# Altium schematic sheet SYZYGY_IO_PORTS.SchDoc
size A3; DrawnBy: Orhun Dabak; SheetNumber: 8; SheetTotal: 8
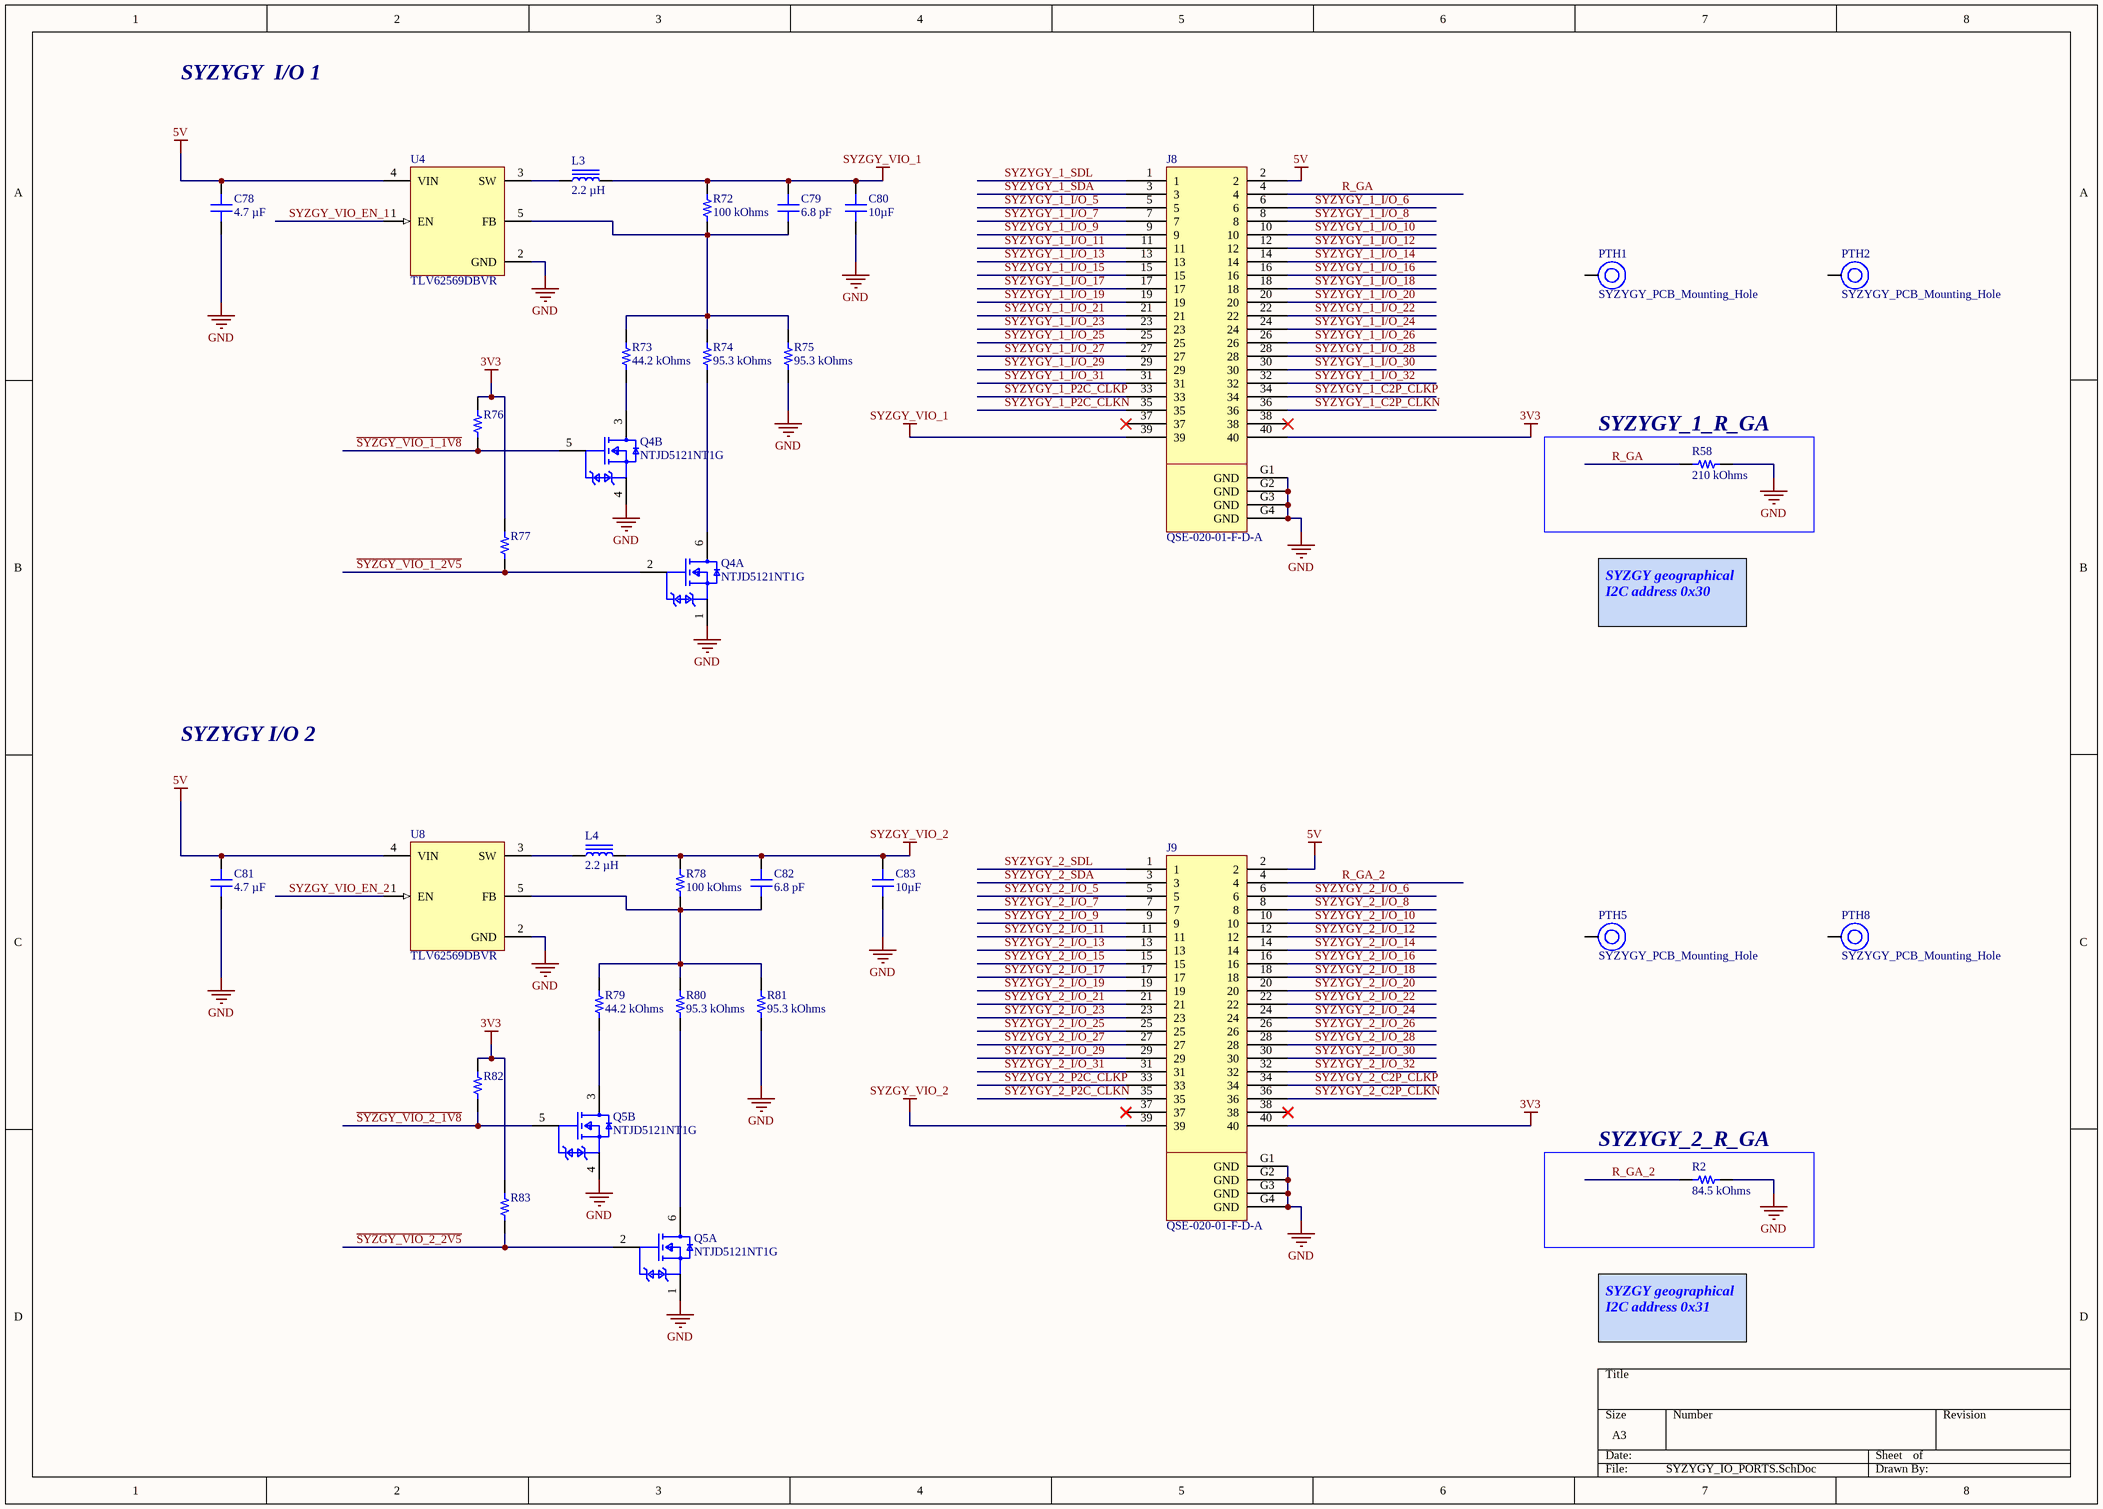
[diagram p0: SYZYGY_IO_PORTS.SchDoc]

## Parts
C78  4.7 µF  [CAP 0805_2012]
C79  6.8 pF  [CAP 0402_1005]
C80  10µF  [CAP 0805_2012]
C81  4.7 µF  [CAP 0805_2012]
C82  6.8 pF  [CAP 0402_1005]
C83  10µF  [CAP 0805_2012]
J8  QSE-020-01-F-D-A  [QSE-020-01-F-D-A-Footprint-1]
J9  QSE-020-01-F-D-A  [QSE-020-01-F-D-A-Footprint-1]
L3  2.2 µH  [TDK VLS252010HBX-1]
L4  2.2 µH  [TDK VLS252010HBX-1]
PTH1  SYZYGY_PCB_Mounting_Hole  [SYZYGY_PCB_Mounting_Hole]  (no BOM)
PTH2  SYZYGY_PCB_Mounting_Hole  [SYZYGY_PCB_Mounting_Hole]  (no BOM)
PTH5  SYZYGY_PCB_Mounting_Hole  [SYZYGY_PCB_Mounting_Hole]  (no BOM)
PTH8  SYZYGY_PCB_Mounting_Hole  [SYZYGY_PCB_Mounting_Hole]  (no BOM)
Q4  NTJD5121NT1G  [FP-419B-02-MFG]  (parts A,B of 2)
Q5  NTJD5121NT1G  [FP-419B-02-MFG]  (parts A,B of 2)
R2  84.5 kOhms  [RES 0402_1005]
R58  210 kOhms  [RES 0402_1005]
R72  100 kOhms  [RES 0402_1005]
R73  44.2 kOhms  [RES 0402_1005]
R74  95.3 kOhms  [RES 0402_1005]
R75  95.3 kOhms  [RES 0402_1005]
R76  10 kOhms  [RES 0201_0603]  (value not drawn)
R77  10 kOhms  [RES 0201_0603]  (value not drawn)
R78  100 kOhms  [RES 0402_1005]
R79  44.2 kOhms  [RES 0402_1005]
R80  95.3 kOhms  [RES 0402_1005]
R81  95.3 kOhms  [RES 0402_1005]
R82  10 kOhms  [RES 0201_0603]  (value not drawn)
R83  10 kOhms  [RES 0201_0603]  (value not drawn)
U4  TLV62569DBVR  [FP-DBV0005A-IPC_C]
U8  TLV62569DBVR  [FP-DBV0005A-IPC_C]

## Blocks framed on the sheet
SYZYGY_1_R_GA: R58
SYZYGY_2_R_GA: R2

## Nets
3V3: J8.40 J9.40 R76.2 R77.2 R82.2 R83.2
5V: C78.2 C81.2 J8.2 J9.2 U4.4(VIN) U8.4(VIN)
GND: C78.1 C80.1 C81.1 C83.1 J8.G1(GND) J8.G2(GND) J8.G3(GND) J8.G4(GND) J9.G1(GND) J9.G2(GND) J9.G3(GND) J9.G4(GND) Q4.1(S1) Q4.4(S2) Q5.1(S1) Q5.4(S2) R2.2 R58.2 R75.1 R81.1 U4.2(GND) U8.2(GND)
SYZGY_VIO_1: C79.2 C80.2 J8.39 L3.2 R72.2
SYZGY_VIO_2: C82.2 C83.2 J9.39 L4.2 R78.2
R_GA: J8.4 R58.1
R_GA_2: J9.4 R2.1
~{SYZGY_VIO_1_1V8}: Q4.5(G2) R76.1
~{SYZGY_VIO_1_2V5}: Q4.2(G1) R77.1
~{SYZGY_VIO_2_1V8}: Q5.5(G2) R82.1
~{SYZGY_VIO_2_2V5}: Q5.2(G1) R83.1
SYZGY_VIO_EN_1: U4.1(EN)
SYZGY_VIO_EN_2: U8.1(EN)
SYZYGY_1_C2P_CLKN: J8.36
SYZYGY_1_C2P_CLKP: J8.34
SYZYGY_1_I/O_5: J8.5
SYZYGY_1_I/O_6: J8.6
SYZYGY_1_I/O_7: J8.7
SYZYGY_1_I/O_8: J8.8
SYZYGY_1_I/O_9: J8.9
SYZYGY_1_I/O_10: J8.10
SYZYGY_1_I/O_11: J8.11
SYZYGY_1_I/O_12: J8.12
SYZYGY_1_I/O_13: J8.13
SYZYGY_1_I/O_14: J8.14
SYZYGY_1_I/O_15: J8.15
SYZYGY_1_I/O_16: J8.16
SYZYGY_1_I/O_17: J8.17
SYZYGY_1_I/O_18: J8.18
SYZYGY_1_I/O_19: J8.19
SYZYGY_1_I/O_20: J8.20
SYZYGY_1_I/O_21: J8.21
SYZYGY_1_I/O_22: J8.22
SYZYGY_1_I/O_23: J8.23
SYZYGY_1_I/O_24: J8.24
SYZYGY_1_I/O_25: J8.25
SYZYGY_1_I/O_26: J8.26
SYZYGY_1_I/O_27: J8.27
SYZYGY_1_I/O_28: J8.28
SYZYGY_1_I/O_29: J8.29
SYZYGY_1_I/O_30: J8.30
SYZYGY_1_I/O_31: J8.31
SYZYGY_1_I/O_32: J8.32
SYZYGY_1_P2C_CLKN: J8.35
SYZYGY_1_P2C_CLKP: J8.33
SYZYGY_1_SDA: J8.3
SYZYGY_1_SDL: J8.1
SYZYGY_2_C2P_CLKN: J9.36
SYZYGY_2_C2P_CLKP: J9.34
SYZYGY_2_I/O_5: J9.5
SYZYGY_2_I/O_6: J9.6
SYZYGY_2_I/O_7: J9.7
SYZYGY_2_I/O_8: J9.8
SYZYGY_2_I/O_9: J9.9
SYZYGY_2_I/O_10: J9.10
SYZYGY_2_I/O_11: J9.11
SYZYGY_2_I/O_12: J9.12
SYZYGY_2_I/O_13: J9.13
SYZYGY_2_I/O_14: J9.14
SYZYGY_2_I/O_15: J9.15
SYZYGY_2_I/O_16: J9.16
SYZYGY_2_I/O_17: J9.17
SYZYGY_2_I/O_18: J9.18
SYZYGY_2_I/O_19: J9.19
SYZYGY_2_I/O_20: J9.20
SYZYGY_2_I/O_21: J9.21
SYZYGY_2_I/O_22: J9.22
SYZYGY_2_I/O_23: J9.23
SYZYGY_2_I/O_24: J9.24
SYZYGY_2_I/O_25: J9.25
SYZYGY_2_I/O_26: J9.26
SYZYGY_2_I/O_27: J9.27
SYZYGY_2_I/O_28: J9.28
SYZYGY_2_I/O_29: J9.29
SYZYGY_2_I/O_30: J9.30
SYZYGY_2_I/O_31: J9.31
SYZYGY_2_I/O_32: J9.32
SYZYGY_2_P2C_CLKN: J9.35
SYZYGY_2_P2C_CLKP: J9.33
SYZYGY_2_SDA: J9.3
SYZYGY_2_SDL: J9.1
NetC79_1: C79.1 R72.1 R73.2 R74.2 R75.2 U4.5(FB)
NetC82_1: C82.1 R78.1 R79.2 R80.2 R81.2 U8.5(FB)
NetL3_1: L3.1 U4.3(SW)
NetL4_1: L4.1 U8.3(SW)
NetQ4_3: Q4.3(D2) R73.1
NetQ4_6: Q4.6(D1) R74.1
NetQ5_3: Q5.3(D2) R79.1
NetQ5_6: Q5.6(D1) R80.1

Not connected (* = marked no-connect by the designer): J8 37* 38*; J9 37* 38*; PTH1 1; PTH2 1; PTH5 1; PTH8 1

## Notes on the sheet
- SYZYGY  I/O 1
- SYZGY geographical I2C address 0x30
- SYZYGY I/O 2
- SYZGY geographical I2C address 0x31

## Library data of the parts
C78 C81 = CL21B475KAFNNNE: CAP CER 4.7UF 25V X7R 0805; manufacturer: Samsung Electro-Mechanics; Tolerance: ±10%; Part Number: CL21B475KAFNNNE; Value: 4.7 µF; Applications: General Purpose; Capacitance: 4.7 µF; componentlink1description: Datasheet; componentlink1url: http://www.samsungsem.com/kr/support/product-search/mlcc/CL21B475KAFNNNE.jsp; componentlink2description: DigiKey Link; componentlink2url: https://www.digikey.com/en/products/detail/samsung-electro-mechanics/CL21B475KAFNNNE/3888627; Device Package: 0805 (2012 Metric); lastupdated: 19/09/2022 13:04:25; Lifecycle Status: Active; Minimum Order: 1; Mounting Type: Surface Mount, MLCC; Operating Temperature: -55°C ~ 125°C; Package / Case: 0805 (2012 Metric); packaging: TapeAndReel; partid: 3072; Part Status: Active; price: 0.09; series: CL; Size / Dimension: 0.079" L x 0.049" W (2.00mm x 1.25mm); Supplier 1: DigiKey; Supplier Part Number 1: 1276-2969-1-ND; Temperature Coefficient: X7R; Thickness (Max): 0.053" (1.35mm); Voltage - Rated: 25V
C79 C82 = 885012005024: CAP CER 6.8PF 16V C0G/NP0 0402; manufacturer: Würth Elektronik; Temperature Coefficient: C0G, NP0; Tolerance: ±0.5pF; Part Number: 885012005024; Value: 6.8 pF; Applications: General Purpose; Capacitance: 6.8 pF; componentlink1description: Datasheet; componentlink1url: https://katalog.we-online.de/pbs/datasheet/885012005024.pdf; componentlink2description: DigiKey Link; componentlink2url: https://www.digikey.com/en/products/detail/würth-elektronik/885012005024/5453295; Device Package: 0402 (1005 Metric); lastupdated: 19/09/2022 12:57:16; Lifecycle Status: Active; Minimum Order: 1; Mounting Type: Surface Mount, MLCC; Operating Temperature: -55°C ~ 125°C; Package / Case: 0402 (1005 Metric); packaging: TapeAndReel; partid: 8046; Part Status: Active; price: 0.01; series: WCAP-CSGP; Size / Dimension: 0.039" L x 0.020" W (1.00mm x 0.50mm); Supplier 1: DigiKey; Supplier Part Number 1: 732-7440-1-ND; Thickness (Max): 0.022" (0.55mm); Voltage - Rated: 16V
C80 C83 = 0805ZC106MAT2A: CAP CER 10UF 10V X7R 0805; manufacturer: AVX Corporation; Tolerance: ±20%; Part Number: 0805ZC106MAT2A; Value: 10µF; Applications: General Purpose; Capacitance: 10µF; componentlink1description: Datasheet; componentlink1url: http://datasheets.avx.com/X7RDielectric.pdf; componentlink2description: DigiKey Link; componentlink2url: http://digikey.com/product-detail/en/avx-corporation/0805ZC106MAT2A/478-11397-1-ND/8019148; Device Package: 0805 (2012 Metric); lastupdated: 02/09/2020 01:04:12; Lifecycle Status: Active; Minimum Order: 1; Mounting Type: Surface Mount, MLCC; Operating Temperature: -55°C ~ 125°C; Package / Case: 0805 (2012 Metric); packaging: CutTape; partid: 16649; Part Status: Active; price: 0.85; series: -; Size / Dimension: 0.079" L x 0.049" W (2.00mm x 1.25mm); Supplier 1: DigiKey; Supplier Part Number 1: 478-11397-1-ND; Temperature Coefficient: X7R; Thickness (Max): 0.060" (1.52mm); Voltage - Rated: 10V
J8 J9 = CMP-002-00073-2: Conn High Speed Socket Strip SKT 40 POS 0.8mm Solder ST SMD Tray
L3 L4 = VLS252010HBX-2R2M-1: FIXED IND 2.2UH 1.76A 120MOHM SM; Manufacturer: TDK Corporation; Current - Saturation: 2.3A; DC Resistance (DCR): 120mOhm Max; Inductance Frequency - Test: 1 MHz; Material - Core: Metal; Shielding: Shielded; Tolerance: ±20%; Type: Drum Core, Wirewound; Part Number: VLS252010HBX-2R2M-1; ComponentLink1Description: Datasheet; ComponentLink1URL: https://product.tdk.com/info/en/catalog/datasheets/inductor_commercial_power_vls252010hbx-1_en.pdf?ref_disty=digikey; ComponentLink2Description: DigiKey Link; ComponentLink2URL: https://www.digikey.com/en/products/detail/tdk-corporation/VLS252010HBX-2R2M-1/4918066; Current Rating (Amps): 1.76 A; Device Package: 1008 (2520 Metric); Height - Seated (Max): 0.039" (1.00mm); Inductance: 2.2 µH; LastUpdated: 9/19/2022 02:01:21 PM; Lifecycle Status: Active; Minimum Order: 1; Mounting Type: Surface Mount; Operating Temperature: -40°C ~ 105°C; Package / Case: 1008 (2520 Metric); Packaging: TapeAndReel; PartId: 3369; Part Status: Active; Price: 0.12; Series: VLS-HBX-1; Size / Dimension: 0.098" L x 0.079" W (2.50mm x 2.00mm); Supplier 1: DigiKey; Supplier Part Number 1: 445-172399-1-ND; Supplier Device Package: 1008 (2520 Metric); Value: 2.2 µH
Q4 Q5 = CMP-013-00036-1: MOSFET 2N-CH 60V 0.295A SOT363
R2 = RC0402FR-0784K5L: RES 84.5K OHM 1% 1/16W 0402; Manufacturer: Yageo; Power (Watts): 0.063W, 1/16W; Temperature Coefficient: ±100ppm/°C; Part Number: RC0402FR-0784K5L; Value: 84.5 kOhms; ComponentLink1Description: Datasheet; ComponentLink1URL: https://www.yageo.com/upload/media/product/productsearch/datasheet/rchip/PYu-RC_Group_51_RoHS_L_10.pdf; ComponentLink2Description: DigiKey Link; ComponentLink2URL: https://www.digikey.com/en/products/detail/yageo/RC0402FR-0784K5L/5281105; Composition: Thick Film; Device Package: 0402 (1005 Metric); Features: Moisture Resistant; Height - Seated (Max): 0.016" (0.40mm); LastUpdated: 9/19/2022 01:15:04 PM; Lifecycle Status: Active; Minimum Order: 1; Number of Terminations: 2; Operating Temperature: -55°C ~ 155°C; Package / Case: 0402 (1005 Metric); Packaging: CutTape; PartId: 2563; Part Status: Active; Price: 0.01; Resistance: 84.5 kOhms; Series: RC_L; Size / Dimension: 0.039" L x 0.020" W (1.00mm x 0.50mm); Supplier 1: DigiKey; Supplier Part Number 1: YAG3245CT-ND; Supplier Device Package: 0402; Tolerance: ±1%
R58 = RC0402FR-07210KL: RES 210K OHM 1% 1/16W 0402; Manufacturer: Yageo; Power (Watts): 0.063W, 1/16W; Temperature Coefficient: ±100ppm/°C; Part Number: RC0402FR-07210KL; Value: 210 kOhms; ComponentLink1Description: Datasheet; ComponentLink1URL: https://www.yageo.com/upload/media/product/productsearch/datasheet/rchip/PYu-RC_Group_51_RoHS_L_10.pdf; ComponentLink2Description: DigiKey Link; ComponentLink2URL: https://www.digikey.com/en/products/detail/yageo/RC0402FR-07210KL/726560; Composition: Thick Film; Device Package: 0402 (1005 Metric); Features: Moisture Resistant; Height - Seated (Max): 0.016" (0.40mm); LastUpdated: 19/09/2022 13:14:10; Lifecycle Status: Active; Minimum Order: 1; Number of Terminations: 2; Operating Temperature: -55°C ~ 155°C; Package / Case: 0402 (1005 Metric); Packaging: CutTape; PartId: 19115; Part Status: Active; Price: 0.01; Resistance: 210 kOhms; Series: RC_L; Size / Dimension: 0.039" L x 0.020" W (1.00mm x 0.50mm); Supplier 1: DigiKey; Supplier Part Number 1: 311-210KLRCT-ND; Supplier Device Package: 0402; Tolerance: ±1%
R72 R78 = AC0402FR-07100KL: RES SMD 100K OHM 1% 1/16W 0402; Manufacturer: Yageo; Power (Watts): 0.063W, 1/16W; Temperature Coefficient: ±100ppm/°C; Part Number: AC0402FR-07100KL; Value: 100 kOhms; ComponentLink1Description: Datasheet; ComponentLink1URL: https://www.yageo.com/upload/media/product/productsearch/datasheet/rchip/PYu-AC_51_RoHS_L_7.pdf; ComponentLink2Description: DigiKey Link; ComponentLink2URL: https://www.digikey.com/en/products/detail/yageo/AC0402FR-07100KL/5895021; Composition: Thick Film; Device Package: 0402 (1005 Metric); Features: Automotive AEC-Q200, Moisture Resistant; Height - Seated (Max): 0.015" (0.37mm); LastUpdated: 19/09/2022 13:14:31; Lifecycle Status: Active; Minimum Order: 1; Number of Terminations: 2; Operating Temperature: -55°C ~ 155°C; Package / Case: 0402 (1005 Metric); Packaging: CutTape; PartId: 12047; Part Status: Active; Price: 0.01; Ratings: AEC-Q200; Resistance: 100 kOhms; Series: AC; Size / Dimension: 0.039" L x 0.020" W (1.00mm x 0.50mm); Supplier 1: DigiKey; Supplier Part Number 1: YAG3434CT-ND; Supplier Device Package: 0402; Tolerance: ±1%
R73 R79 = RC0402FR-0744K2L: RES 44.2K OHM 1% 1/16W 0402; Manufacturer: Yageo; Power (Watts): 0.063W, 1/16W; Temperature Coefficient: ±100ppm/°C; Part Number: RC0402FR-0744K2L; Value: 44.2 kOhms; ComponentLink1Description: Datasheet; ComponentLink1URL: https://www.yageo.com/upload/media/product/productsearch/datasheet/rchip/PYu-RC_Group_51_RoHS_L_10.pdf; ComponentLink2Description: DigiKey Link; ComponentLink2URL: https://www.digikey.com/en/products/detail/yageo/RC0402FR-0744K2L/5281023; Composition: Thick Film; Device Package: 0402 (1005 Metric); Features: Moisture Resistant; Height - Seated (Max): 0.016" (0.40mm); LastUpdated: 19/09/2022 13:15:04; Lifecycle Status: Active; Minimum Order: 1; Number of Terminations: 2; Operating Temperature: -55°C ~ 155°C; Package / Case: 0402 (1005 Metric); Packaging: CutTape; PartId: 2628; Part Status: Active; Price: 0.01; Resistance: 44.2 kOhms; Series: RC_L; Size / Dimension: 0.039" L x 0.020" W (1.00mm x 0.50mm); Supplier 1: DigiKey; Supplier Part Number 1: YAG3163CT-ND; Supplier Device Package: 0402; Tolerance: ±1%
R74 R75 R80 R81 = RC0402FR-0795K3L: RES 95.3K OHM 1% 1/16W 0402; Manufacturer: Yageo; Power (Watts): 0.063W, 1/16W; Temperature Coefficient: ±100ppm/°C; Part Number: RC0402FR-0795K3L; Value: 95.3 kOhms; ComponentLink1Description: Datasheet; ComponentLink1URL: https://www.yageo.com/upload/media/product/productsearch/datasheet/rchip/PYu-RC_Group_51_RoHS_L_10.pdf; ComponentLink2Description: DigiKey Link; ComponentLink2URL: https://www.digikey.com/en/products/detail/yageo/RC0402FR-0795K3L/726673; Composition: Thick Film; Device Package: 0402 (1005 Metric); Features: Moisture Resistant; Height - Seated (Max): 0.016" (0.40mm); LastUpdated: 19/09/2022 13:14:10; Lifecycle Status: Active; Minimum Order: 1; Number of Terminations: 2; Operating Temperature: -55°C ~ 155°C; Package / Case: 0402 (1005 Metric); Packaging: CutTape; PartId: 18950; Part Status: Active; Price: 0.01; Resistance: 95.3 kOhms; Series: RC_L; Size / Dimension: 0.039" L x 0.020" W (1.00mm x 0.50mm); Supplier 1: DigiKey; Supplier Part Number 1: 311-95.3KLRCT-ND; Supplier Device Package: 0402; Tolerance: ±1%
R76 R77 R82 R83 = RC0201FR-0710KL: RES 10K OHM 1% 1/20W 0201; Manufacturer: Yageo; Power (Watts): 0.05W, 1/20W; Temperature Coefficient: ±200ppm/°C; Part Number: RC0201FR-0710KL; Value: 10 kOhms; ComponentLink1Description: Datasheet; ComponentLink1URL: https://www.yageo.com/upload/media/product/productsearch/datasheet/rchip/PYu-RC_Group_51_RoHS_L_10.pdf; ComponentLink2Description: DigiKey Link; ComponentLink2URL: https://www.digikey.com/en/products/detail/yageo/RC0201FR-0710KL/1948870; Composition: Thick Film; Device Package: 0201 (0603 Metric); Features: Moisture Resistant; Height - Seated (Max): 0.010" (0.26mm); LastUpdated: 19/09/2022 13:09:03; Lifecycle Status: Active; Minimum Order: 1; Number of Terminations: 2; Operating Temperature: -55°C ~ 125°C; Package / Case: 0201 (0603 Metric); Packaging: CutTape; PartId: 2281; Part Status: Active; Price: 0.01; Resistance: 10 kOhms; Series: RC_L; Size / Dimension: 0.024" L x 0.012" W (0.60mm x 0.30mm); Supplier 1: DigiKey; Supplier Part Number 1: 311-10.0KMCT-ND; Supplier Device Package: 0201; Tolerance: ±1%
U4 U8 = CMP-019-00054-4: Conv DC-DC 2.5V to 5.5V Synchronous Step Down Single-Out 0.6V to 5.5V 2A 5-Pin SOT-23 T/R